# Altium schematic sheet 07_LTE_GNSS.SchDoc: LTE_GNSS
size 420 x 297 mm; DrawnBy: YILDIRIM_DOGRU
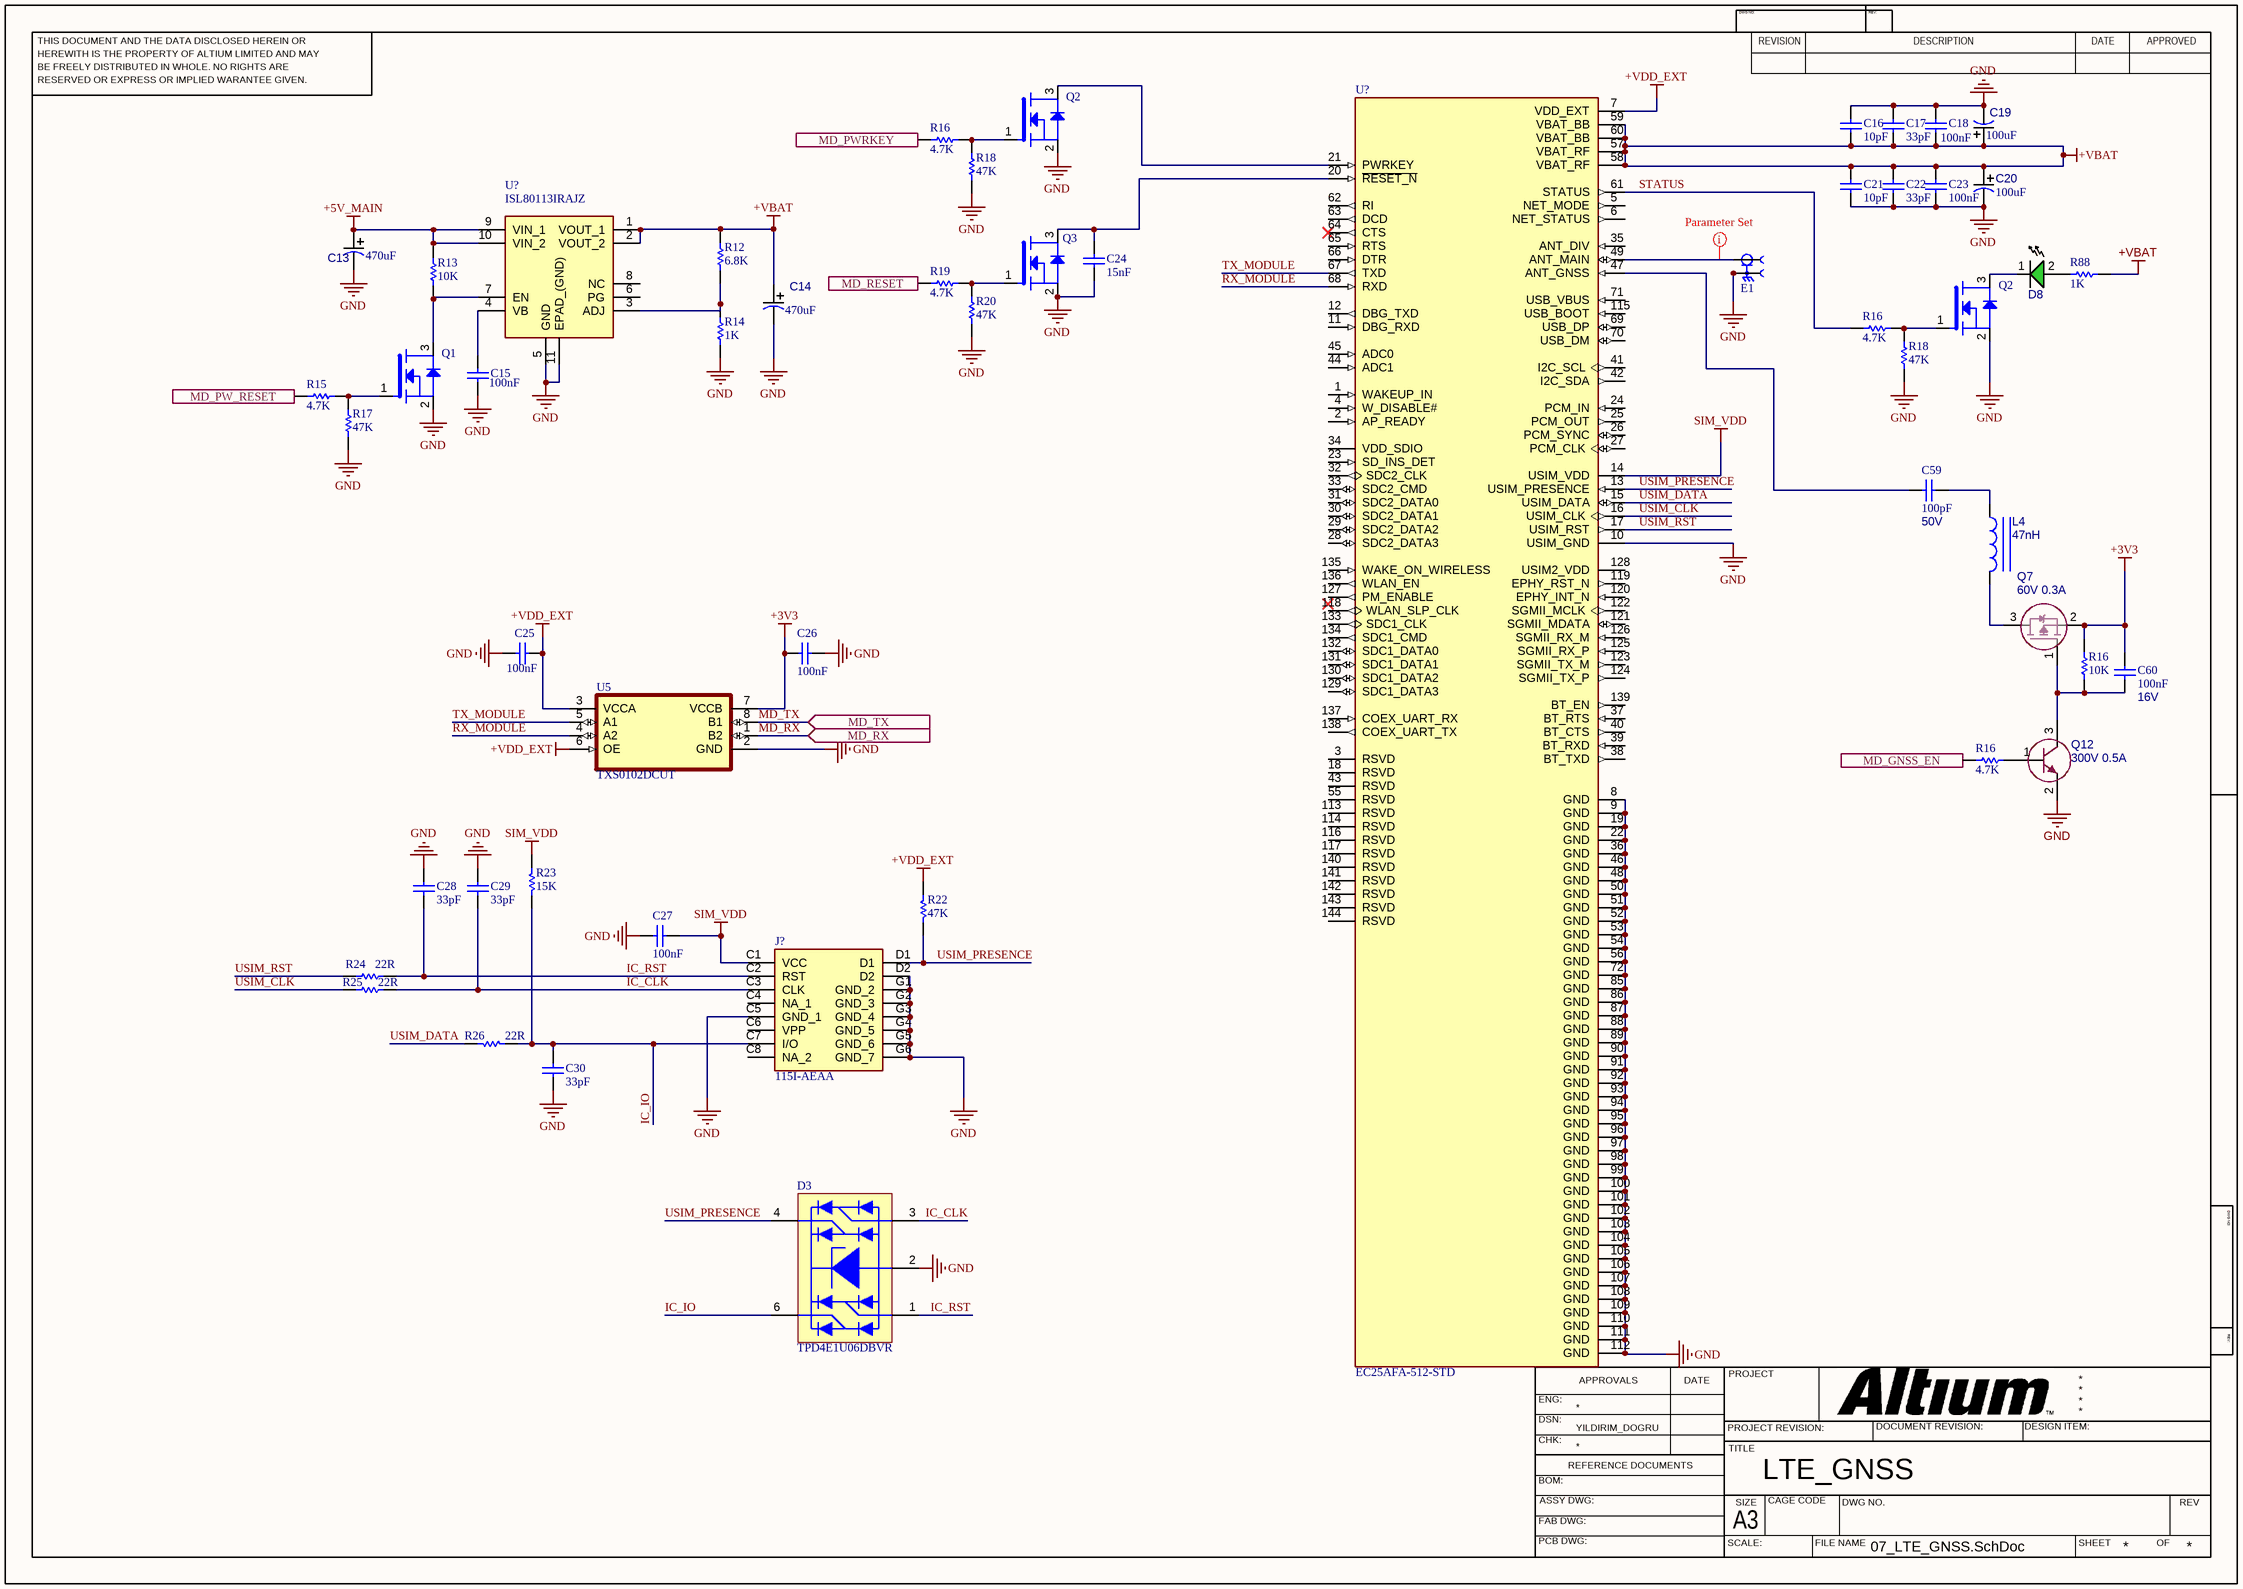
[diagram p0: 07_LTE_GNSS.SchDoc]

## Parts
(Parts that share a designator on the sheet are numbered #1, #2 ... from top to bottom, then left to right.)
C13  value 470uF  [CAP_ELEC_8X10.5 mm]  (hidden comment: MRW-016V471MF105-T/R)
C14  value 470uF  [CAP_ELEC_8X10.5 mm]  (hidden comment: MRW-016V471MF105-T/R)
C15  value 100nF  [CAP_0603]  (hidden comment: CL10B104KB8NNNL)
C16  value 10pF  [CAP_0603]  (hidden comment: CL10C100CB8NNNC)
C17  value 33pF  [CAP_0603]  (hidden comment: CL10C330JB8NNNC)
C18  value 100nF  [CAP_0603]  (hidden comment: CL10B104KB8NNNL)
C19  value 100uF  [TANTALIUM_BCASE]  (hidden comment: T491B107K006AT)
C20  value 100uF  [TANTALIUM_BCASE]  (hidden comment: T491B107K006AT)
C21  value 10pF  [CAP_0603]  (hidden comment: CL10C100CB8NNNC)
C22  value 33pF  [CAP_0603]  (hidden comment: CL10C330JB8NNNC)
C23  value 100nF  [CAP_0603]  (hidden comment: CL10B104KB8NNNL)
C24  value 15nF  [CAP_0603]  (hidden comment: CL10B153KB85PNC)
C25  value 100nF  [CAP_0603]  (hidden comment: CL10B104KB8NNNL)
C26  value 100nF  [CAP_0603]  (hidden comment: CL10B104KB8NNNL)
C27  value 100nF  [CAP_0603]  (hidden comment: CL10B104KB8NNNL)
C28  value 33pF  [CAP_0603]  (hidden comment: CL10C330JB8NNNC)
C29  value 33pF  [CAP_0603]  (hidden comment: CL10C330JB8NNNC)
C30  value 33pF  [CAP_0603]  (hidden comment: CL10C330JB8NNNC)
C59  value 100pF  Voltage: 50V  [CAP_0402]  (hidden comment: CC0402JRNPO9BN101)
C60  value 100nF  Voltage: 16V  [CAP_0402]  (hidden comment: CL05B104KO5NNNC)
D3  TPD4E1U06DBVR  [SOT23_6]
D8  LTST-C190TGKT  [LED_0603_GREEN]  (value not drawn)
E1  L-KLS1-SMA002-B  [SMA_JACK_90]  (value not drawn)
J?  115I-AEAA  [115IAEAA]
L4  value 47nH  [RES_0402]  (hidden comment: LQG15HS47NJ02D)
Q1  BSS138W-7-F  [SOT323]  (value not drawn)
Q2#1  BSS138W-7-F  [SOT323]  (value not drawn)
Q2#2  BSS138W-7-F  [SOT323]  (value not drawn)
Q3  BSS138W-7-F  [SOT323]  (value not drawn)
Q7  value 60V 0.3A  [SOT23]  (hidden comment: PJA3439_R1_00001)
Q12  value 300V 0.5A  [SOT-23-3]  (hidden comment: MMBTA42_R1_00001)
R12  value 6.8K  [RES_0603]  (hidden comment: 0603SAF6801T5E)
R13  value 10K  [RES_0603]  (hidden comment: 0603SAF1002T5E)
R14  value 1K  [RES_0603]  (hidden comment: 0603SAF1001T5E)
R15  value 4.7K  [RES_0603]  (hidden comment: 0603SAF4701T5E)
R16#1  value 4.7K  [RES_0603]  (hidden comment: 0603SAF4701T5E)
R16#2  value 4.7K  [RES_0603]  (hidden comment: 0603SAF4701T5E)
R16#3  value 10K  [RES_0402]  (hidden comment: RC0402JR-0710KL)
R16#4  value 4.7K  [RES_0603]  (hidden comment: 0603SAF4701T5E)
R17  value 47K  [RES_0603]  (hidden comment: 0603SAF4702T5E)
R18#1  value 47K  [RES_0603]  (hidden comment: 0603SAF4702T5E)
R18#2  value 47K  [RES_0603]  (hidden comment: 0603SAF4702T5E)
R19  value 4.7K  [RES_0603]  (hidden comment: 0603SAF4701T5E)
R20  value 47K  [RES_0603]  (hidden comment: 0603SAF4702T5E)
R22  value 47K  [RES_0603]  (hidden comment: 0603SAF4702T5E)
R23  value 15K  [RES_0603]  (hidden comment: 0603SAJ0153T5E)
R24  value 22R  [RES_0603]  (hidden comment: 0603SAJ0220T5E)
R25  value 22R  [RES_0603]  (hidden comment: 0603SAJ0220T5E)
R26  value 22R  [RES_0603]  (hidden comment: 0603SAJ0220T5E)
R88  value 1K  [RES_0603]  (hidden comment: RES)
U5  TXS0102DCUT  [8_VSSOP]
U?#1  EC25AFA-512-STD  [XCVR_EC25AFA-512-STD]
U?#2  ISL80113IRAJZ  [ISL80101IRAJZ]

## Ports
MD_GNSS_EN (in), MD_PW_RESET (in), MD_PWRKEY (in), MD_RESET (in), MD_RX (in), MD_TX (in)

## Nets
+3V3: C26.1 C60.1 Q7.2(S) R16#3.1 U5.7(VCCB)
+5V_MAIN: C13.1 R13.2 U?#2.9(VIN_1) U?#2.10(VIN_2)
+VBAT: C14.1 C16.1 C17.1 C18.1 C19.1 C20.1 C21.2 C22.2 C23.2 R12.2 R88.2 U?#1.57(VBAT_RF) U?#1.58(VBAT_RF) U?#1.59(VBAT_BB) U?#1.60(VBAT_BB) U?#2.1(VOUT_1) U?#2.2(VOUT_2)
+VDD_EXT: C25.1 R22.2 U5.3(VCCA) U5.6(OE) U?#1.7(VDD_EXT)
GND: C13.2 C14.2 C15.1 C16.2 C17.2 C18.2 C19.2 C20.2 C21.1 C22.1 C23.1 C24.1 C25.2 C26.2 C27.2 C28.1 C29.1 C30.1 D3.2 E1.S1 E1.S2 E1.S3 E1.S4 J?.C5(GND_1) J?.D2 J?.G1(GND_2) J?.G2(GND_3) J?.G3(GND_4) J?.G4(GND_5) J?.G5(GND_6) J?.G6(GND_7) Q1.2(S) Q2#1.2(S) Q2#2.2(S) Q3.2(S) Q12.2(E) R14.1 R17.1 R18#1.1 R18#2.1 R20.1 U5.2(GND) U?#1.8(GND) U?#1.9(GND) U?#1.10(USIM_GND) U?#1.19(GND) U?#1.22(GND) U?#1.36(GND) U?#1.46(GND) U?#1.48(GND) U?#1.50(GND) U?#1.51(GND) U?#1.52(GND) U?#1.53(GND) U?#1.54(GND) U?#1.56(GND) U?#1.72(GND) U?#1.85(GND) U?#1.86(GND) U?#1.87(GND) U?#1.88(GND) U?#1.89(GND) U?#1.90(GND) U?#1.91(GND) U?#1.92(GND) U?#1.93(GND) U?#1.94(GND) U?#1.95(GND) U?#1.96(GND) U?#1.97(GND) U?#1.98(GND) U?#1.99(GND) U?#1.100(GND) U?#1.101(GND) U?#1.102(GND) U?#1.103(GND) U?#1.104(GND) U?#1.105(GND) U?#1.106(GND) U?#1.107(GND) U?#1.108(GND) U?#1.109(GND) U?#1.110(GND) U?#1.111(GND) U?#1.112(GND) U?#2.5(GND) U?#2.11(EPAD_(GND))
SIM_VDD: C27.1 J?.C1(VCC) R23.2 U?#1.14(USIM_VDD)
IC_CLK: C29.2 D3.3 J?.C3(CLK) R25.2
IC_IO: C30.2 D3.6 J?.C7(I/O) R23.1 R26.1
IC_RST: C28.2 D3.1 J?.C2(RST) R24.2
MD_GNSS_EN: R16#4.1 ; port MD_GNSS_EN
MD_PW_RESET: R15.1 ; port MD_PW_RESET
MD_PWRKEY: R16#1.1 ; port MD_PWRKEY
MD_RESET: R19.1 ; port MD_RESET
MD_RX: U5.1(B2) ; port MD_RX
MD_TX: U5.8(B1) ; port MD_TX
RX_MODULE: U5.4(A2) U?#1.68(RXD)
STATUS: R16#2.1 U?#1.61(STATUS)
TX_MODULE: U5.5(A1) U?#1.67(TXD)
USIM_CLK: R25.1 U?#1.16(USIM_CLK)
USIM_DATA: R26.2 U?#1.15(USIM_DATA)
USIM_PRESENCE: D3.4 J?.D1 R22.1 U?#1.13(USIM_PRESENCE)
USIM_RST: R24.1 U?#1.17(USIM_RST)
NetC15_2: C15.2 U?#2.4(VB)
NetC24_2: C24.2 Q3.3(D) U?#1.20(~{RESET_N})
NetC59_1: C59.1 L4.1
NetC59_2: C59.2 U?#1.47(ANT_GNSS)
NetC60_2: C60.2 Q7.1(G) Q12.3(C) R16#3.2
NetD8_1: D8.1 Q2#2.3(D)
NetD8_2: D8.2 R88.1
NetE1_1: E1.1 U?#1.49(ANT_MAIN)
NetL4_2: L4.2 Q7.3(D)
NetQ1_1: Q1.1(G) R15.2 R17.2
NetQ1_3: Q1.3(D) R13.1 U?#2.7(EN)
NetQ2#1_1: Q2#1.1(G) R16#1.2 R18#1.2
NetQ2#1_3: Q2#1.3(D) U?#1.21(PWRKEY)
NetQ2#2_1: Q2#2.1(G) R16#2.2 R18#2.2
NetQ3_1: Q3.1(G) R19.2 R20.2
NetQ12_1: Q12.1(B) R16#4.2
NetR12_1: R12.1 R14.2 U?#2.3(ADJ)

Not connected (* = marked no-connect by the designer): J? C4(NA_1) C6(VPP) C8(NA_2); U?#1 1(WAKEUP_IN) 2(AP_READY) 3(RSVD) 4(W_DISABLE#) 5(NET_MODE) 6(NET_STATUS) 11(DBG_RXD) 12(DBG_TXD) 18(RSVD) 23(SD_INS_DET) 24(PCM_IN) 25(PCM_OUT) 26(PCM_SYNC) 27(PCM_CLK) 28(SDC2_DATA3) 29(SDC2_DATA2) 30(SDC2_DATA1) 31(SDC2_DATA0) 32(SDC2_CLK) 33(SDC2_CMD) 34(VDD_SDIO) 35(ANT_DIV) 37(BT_RTS) 38(BT_TXD) 39(BT_RXD) 40(BT_CTS) 41(I2C_SCL) 42(I2C_SDA) 43(RSVD) 44(ADC1) 45(ADC0) 55(RSVD) 62(RI) 63(DCD) 64(CTS)* 65(RTS) 66(DTR) 69(USB_DP) 70(USB_DM) 71(USB_VBUS) 113(RSVD) 114(RSVD) 115(USB_BOOT) 116(RSVD) 117(RSVD) 118(WLAN_SLP_CLK) 119(EPHY_RST_N) 120(EPHY_INT_N) 121(SGMII_MDATA) 122(SGMII_MCLK) 123(SGMII_TX_M) 124(SGMII_TX_P) 125(SGMII_RX_P) 126(SGMII_RX_M) 127(PM_ENABLE) 128(USIM2_VDD) 129(SDC1_DATA3) 130(SDC1_DATA2) 131(SDC1_DATA1) 132(SDC1_DATA0) 133(SDC1_CLK) 134(SDC1_CMD) 135(WAKE_ON_WIRELESS) 136(WLAN_EN) 137(COEX_UART_RX) 138(COEX_UART_TX) 139(BT_EN) 140(RSVD) 141(RSVD) 142(RSVD) 143(RSVD) 144(RSVD); U?#2 6(PG) 8(NC)

## Layout directives
rule Width Constraint [Pref Width = 0.389mm    Min Width = 0.254mm    Max Width = 0.389mm]: NetE1_1

## Notes on the sheet
- THIS DOCUMENT AND THE DATA DISCLOSED HEREIN OR
- HEREWITH IS THE PROPERTY OF ALTIUM LIMITED AND MAY
- DWG NO:
- REVISION
- REV:
- DESCRIPTION
- DATE
- APPROVED
- BE FREELY DISTRIBUTED IN WHOLE. NO RIGHTS ARE
- RESERVED OR EXPRESS OR IMPLIED WARANTEE GIVEN.
- ENG:
- APPROVALS
- PROJECT
- DSN:
- CHK:
- REFERENCE DOCUMENTS
- PROJECT REVISION:
- TITLE
- DOCUMENT REVISION:
- DESIGN ITEM:
- BOM:
- FAB DWG:
- PCB DWG:
- ASSY DWG:
- SCALE:
- A3
- SIZE
- CAGE CODE
- FILE NAME
- DWG NO.
- SHEET
- OF
- REV

## Library data of the parts
C13 C14 = MRW-016V471MF105-T/R: CAP.EL.470uF 16V 8x10.5 105C 2000Hrs SMD; Manufacturer: KOSHIN; Manufacturer Part Number: MRW-016V471MF105-T/R; Supplier 1: Ozdisan
C15 C18 C23 C25-C27 = CL10B104KB8NNNL: MLCC (1608) 0603 100nF 50VDC ±10% X7R; Manufacturer: Samsung Electro-Mechanics America, Inc; Supplier 1: OZDISAN; Manufacturer Part Number: CL10B104KB8NNNL
C16 C21 = CL10C100CB8NNNC: MLCC (1608) 0603 10pF 50VDC ±0.25pF C0G (NP0); Manufacturer: SAMSUNG; Supplier 1: Ozdisan; Manufacturer Part Number: CL10C100CB8NNNC
C17 C22 C28-C30 = CL10C330JB8NNNC: MLCC (1608) 0603 33pF 50VDC ±5% C0G (NP0); Manufacturer: Samsung Electro-Mechanics America, Inc; Supplier 1: OZDISAN; Manufacturer Part Number: CL10C330JB8NNNC
C19 C20 = T491B107K006AT: CAP.TANTAL 100uF 6.3V 10% B CASE (3528) SMD KEMET; Manufacturer: KEMET; Manufacturer Part Number: T491B107K006AT; Supplier 1: Ozdisan
C24 = CL10B153KB85PNC: MLCC (1608) 0603 15nF 50VDC ±10% X7R AUTOMOTIVE; Manufacturer: SAMSUNG; Supplier 1: OZDISAN; Manufacturer Part Number: CL10B153KB85PNC
C59 = CL10B103KB8NNNL: MLCC (1005) 0402 100pF 50VDC ±5% C0G (NP0); Manufacturer: YAGEO; Manufacturer Part Number: CC0402JRNPO9BN101
C60 = CL10B103KB8NNNL: MLCC (1005) 0402 100nF 16VDC ±10% X7R; Manufacturer: SAMSUNG; Manufacturer Part Number: CL05B104KO5NNNC
D3 = TPD4E1U06DBVR: DIODE TVS 45W 15V SOT23-6; Manufacturer: TEXAS; Value: *; Supplier 1: OZDISAN; Manufacturer Part Number: TPD4E1U06DBVR
D8 = LTST-C190TGKT: LED SMD 0603 GREEN 71-450mcd 130° WATER CLEAR; Manufacturer: LITEON; Package: 0603(1608 Metric); Manufacturer Part Number: LTST-C190TGKT; Value: GREEN
E1 = L-KLS1-SMA002-B: CONNECTOR ANTENNA SMA JACK R/A 50M; Manufacturer: KLS ELECTRONIC; Manufacturer Part Number: L-KLS1-SMA002-B; Supplier 1: OZDISAN
J? = 115I-AEAA: Connector; Manufacturer_Name: ATTEND; Datasheet Link: https://www.attend.com.tw/data/download/file/115I-AEAA.pdf; Height: 1.52mm; Manufacturer_Part_Number: 115I-AEAA
L4 = CBC3225T100MR: INDUCTOR FIXED 0402 47nH 300mA SMD; Manufacturer: MURATA; Package: 0402 (1005 Metric); Manufacturer Part Number: LQG15HS47NJ02D
Q1 Q2#1 Q2#2 Q3 = BSS138W-7-F: MOSFET DIS.200mA 50V N-CH SC70-3; Manufacturer: DIODES; Value: *; Supplier 1: OZDISAN; Manufacturer Part Number: BSS138W-7-F
Q7 = PJA3439_R1_00001: MOSFET P-CH 60V 300mA SOT23 SMT; Manufacturer: Panjit International Inc.; Package: SOT23; Manufacturer Part Number: PJA3439_R1_00001; Supplier Part Number 1: 3757-PJA3439_R1_00001TR-ND; Supplier Part Number 2: 241-PJA3439_R1_00001; Supplier Part Number 3: PJA3439_R1_00001; Supplier 1: DIGIKEY; Supplier 2: MOUSER; Supplier 3: OZDISAN
Q12 = MMBTA42_R1_00001: TRANSISTOR DIS.500mA 300V NPN SOT23 GEN. SMT; Manufacturer: PANJIT; Package: SOT23; Supplier Part Number 1: 3757-MMBTA42_R1_00001CT-ND; Supplier Part Number 2: *; Supplier Part Number 3: MMBTA42_R1_00001; Supplier 1: DIGIKEY; Supplier 2: MOUSER; Supplier 3: OZDISAN; Manufacturer Part Number: MMBTA42_R1_00001
R12 = 0603SAF6801T5E: RES.(1608) 0603 6.8K Ohms 1% 1/10W-S 100PPM; Manufacturer: ROYALOHM; Supplier 1: Ozdisan; Manufacturer Part Number: 0603SAF6801T5E
R13 = 0603SAF1002T5E: RES.(1608) 0603 10K Ohms 1% 1/10W-S 100PPM; Manufacturer: ROYALOHM; Supplier 1: Ozdisan; Manufacturer Part Number: 0603SAF1002T5E
R14 = 0603SAF1001T5E: RES.(1608) 0603 1K Ohms 1% 1/10W-S 100PPM; Manufacturer: ROYALOHM; Supplier 1: Ozdisan; Manufacturer Part Number: 0603SAF1001T5E
R15 R16#1 R16#2 R16#4 R19 = 0603SAF4701T5E: RES.(1608) 0603 4.7K Ohms 1% 1/10W-S 100PPM; Manufacturer: ROYALOHM; Supplier 1: Ozdisan; Manufacturer Part Number: 0603SAF4701T5E
R16#3 = R03000: RES.(1005) 0402 10K Ohms 5% 1/16W 100PPM SMT; Manufacturer: YAGEO; Manufacturer Part Number: RC0402JR-0710KL
R17 R18#1 R18#2 R20 R22 = 0603SAF4702T5E: RES.(1608) 0603 47K Ohms 1% 1/10W-S 100PPM; Manufacturer: ROYALOHM; Supplier 1: Ozdisan; Manufacturer Part Number: 0603SAF4702T5E
R23 = 0603SAJ0153T5E: RES.(1608) 0603 15K Ohms 5% 1/10W-S 100PPM; Manufacturer: ROYALOHM; Supplier 1: Ozdisan; Manufacturer Part Number: 0603SAJ0153T5E
R24-R26 = 0603SAJ0220T5E: RES.(1608) 0603 22 Ohms 5% 1/10W-S 200PPM; Manufacturer: ROYALOHM; Supplier 1: Ozdisan; Manufacturer Part Number: 0603SAJ0220T5E
R88 = R02998: RES 0603 1K Ohms 1% 1/10W-S 100PPM; Manufacturer: ROYALOHM; Manufacturer Part Number: 0603SAF1001T5E
U5 = TXS0102DCUT: Voltage Level Translator Bidirectional 1 Circuit 2 Channel 24Mbps 8-VSSOP; Manufacturer: Texas Instruments; Value: *; Supplier 1: DIGIKEY; Manufacturer Part Number: TXS0102DCUT
U?#1 = EC25AFA-512-STD: Quectel EC25 is a series of 4G - LTE Cat 4 module optimized specially for M2M and IoT applications.; Availability: In Stock; Package: Custom Quectel; MP: EC25AFA-512-STD; SnapEDA_Link: https://www.snapeda.com/parts/EC25AFA-512-STD/Quectel/view-part/?ref=snap; MF: Quectel; Purchase-URL: https://pricing.snapeda.com/search/part/EC25AFA-512-STD/?ref=eda; Value: *; Check_prices: https://www.snapeda.com/parts/EC25AFA-512-STD/Quectel/view-part/?ref=eda; Price: None
U?#2 = ISL80113IRAJZ: Linear Voltage Regulator IC Positive Adjustable 1 Output 3A 10-DFN (3x3); Manufacturer: Renesas Electronics Corporation; Value: IC REG LINEAR POS ADJ 3A 10DFN; Supplier 1: DIGIKEY; Manufacturer Part Number: ISL80113IRAJZ